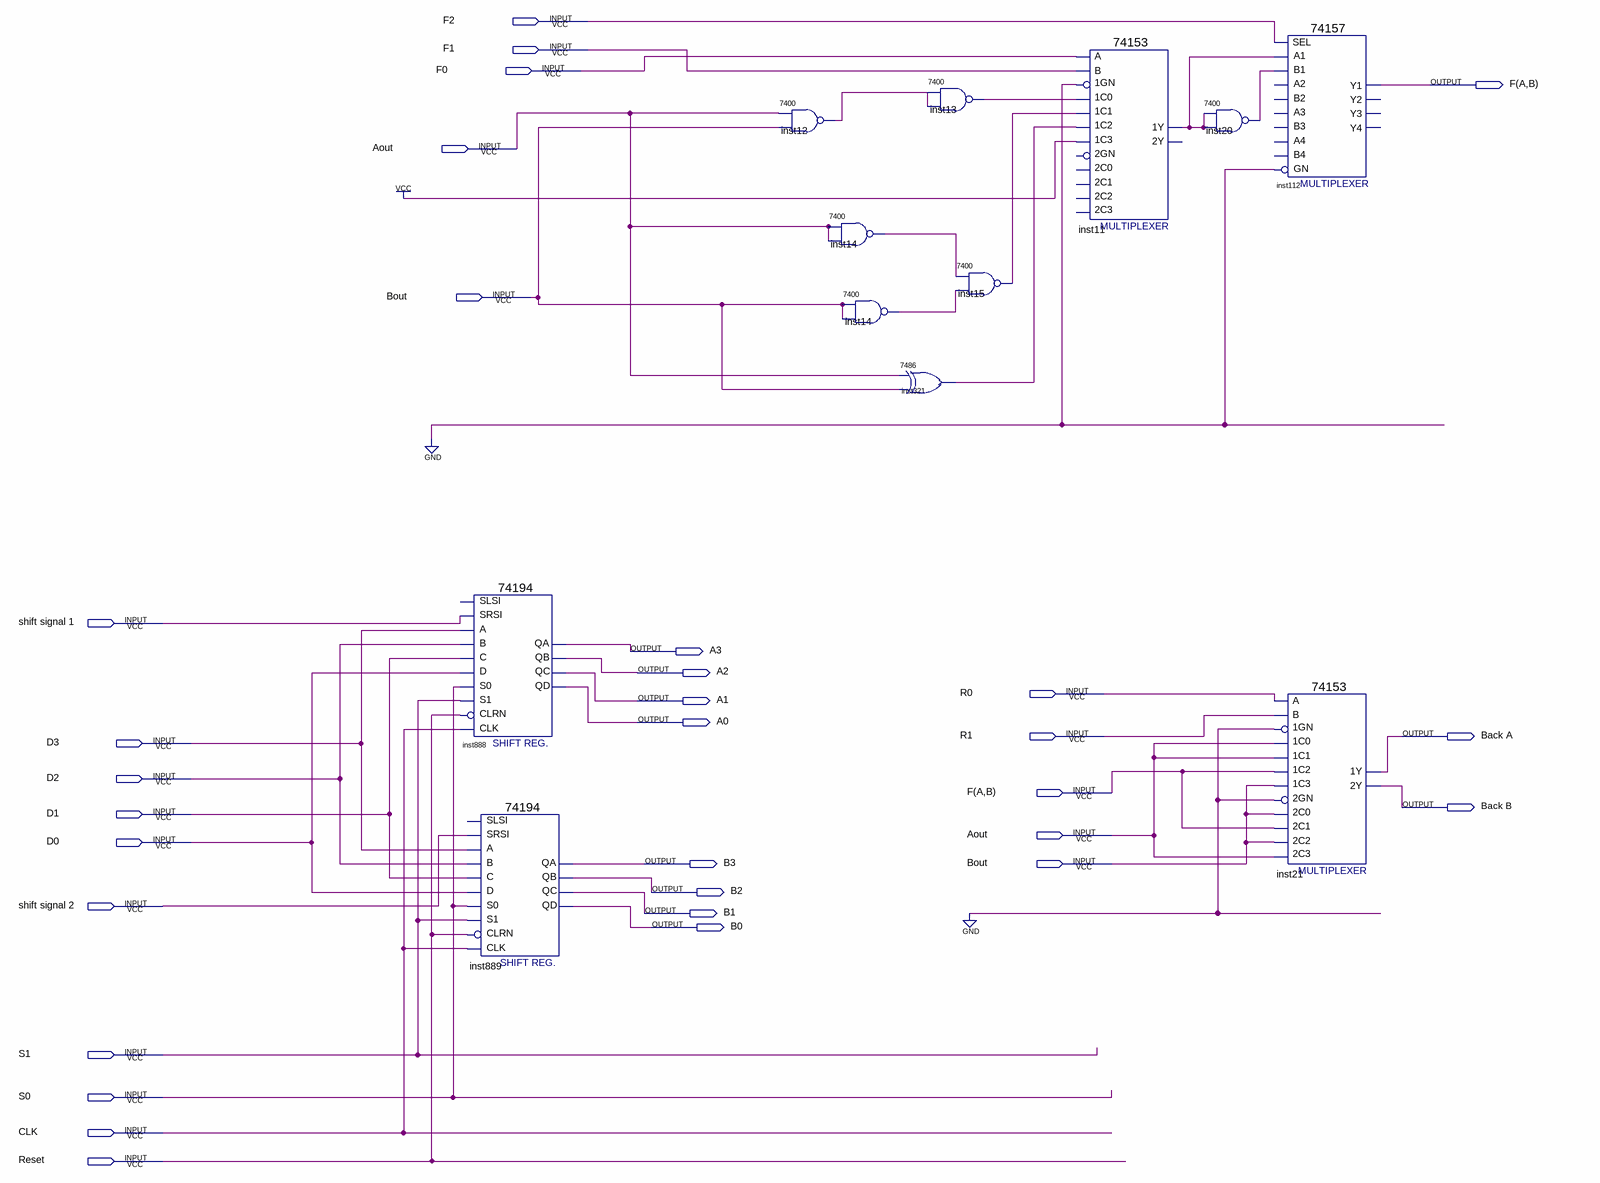
[diagram p0: schematic sheet]
// Quartus schematic report using diagram.bdf as structural Verilog: 12 symbols, 31 pins
module \report_using_diagram  (
  input  F2,
  input  F1,
  input  F0,
  input  Aout,
  input  Bout,
  input  \shift_signal_1 ,
  input  R0,
  input  R1,
  input  D3,
  input  D2,
  inout  \F(A ,
  inout  \B) ,
  input  D1,
  input  D0,
  input  \shift_signal_2 ,
  input  S1,
  input  S0,
  input  CLK,
  input  Reset,
  output A3,
  output A2,
  output A1,
  output A0,
  output \Back_A ,
  output \Back_B ,
  output B3,
  output B2,
  output B1,
  output B0
);

  wire inst11_1y, inst12_1, inst13_1, inst14_1, inst14_1_2, inst15_1, inst20_1, inst112_y1, inst321_1,
       undriven;

  \74194  inst888 (
    .SRSI(\shift_signal_1 ), .B(D2), .C(D1), .CLK(CLK), .CLRN(Reset), .D(D0), .S1(S1), .S0(S0), .A(D3),
    .QA(A3), .QB(A2), .QC(A1), .QD(A0));  // open: SLSI
  \74194  inst889 (
    .SRSI(\shift_signal_2 ), .B(D2), .C(D1), .CLK(CLK), .CLRN(Reset), .D(D0), .S1(S1), .S0(S0), .A(D3),
    .QA(B3), .QB(B2), .QC(B1), .QD(B0));  // open: SLSI
  \7400  inst12 (.\3 (Bout), .\2 (Aout), .\1 (inst12_1));
  \7400  inst14 (.\3 (Aout), .\2 (Aout), .\1 (inst14_1));
  \7400  inst14_dup2 (.\3 (Bout), .\2 (Bout), .\1 (inst14_1_2));
  \7400  inst13 (.\3 (inst12_1), .\2 (inst12_1), .\1 (inst13_1));
  \7486  inst321 (.\2 (Aout), .\3 (Bout), .\1 (inst321_1));
  \7400  inst15 (.\3 (inst14_1_2), .\2 (inst14_1), .\1 (inst15_1));
  \74153  inst11 (
    .\1C1 (inst15_1), .\1GN (1'b0), .\1C0 (inst13_1), .\1C2 (inst321_1), .\1C3 (1'b1), .B(F1), .A(F0),
    .\1Y (inst11_1y));  // open: 2C0, 2GN, 2C2, 2C1, 2C3, 2Y
  \7400  inst20 (.\3 (inst11_1y), .\2 (inst11_1y), .\1 (inst20_1));
  \74157  inst112 (
    .A1(inst11_1y), .B1(inst20_1), .SEL(F2), .GN(1'b0), .Y1(inst112_y1));  // open: B2, A3, B3, A2, B4, A4, Y2, Y4, Y3
  \74153  inst21 (
    .\1C1 (Aout), .\1GN (1'b0), .\1C0 (Aout), .\2C0 (Bout), .\2GN (1'b0), .\2C2 (Bout), .\1C2 (undriven),
    .\1C3 (Bout), .B(R1), .A(R0), .\2C1 (undriven), .\2C3 (Aout), .\1Y (\Back_A ), .\2Y (\Back_B ));
endmodule
